# EAGLE design amplifier (EAGLE 7.6.0)
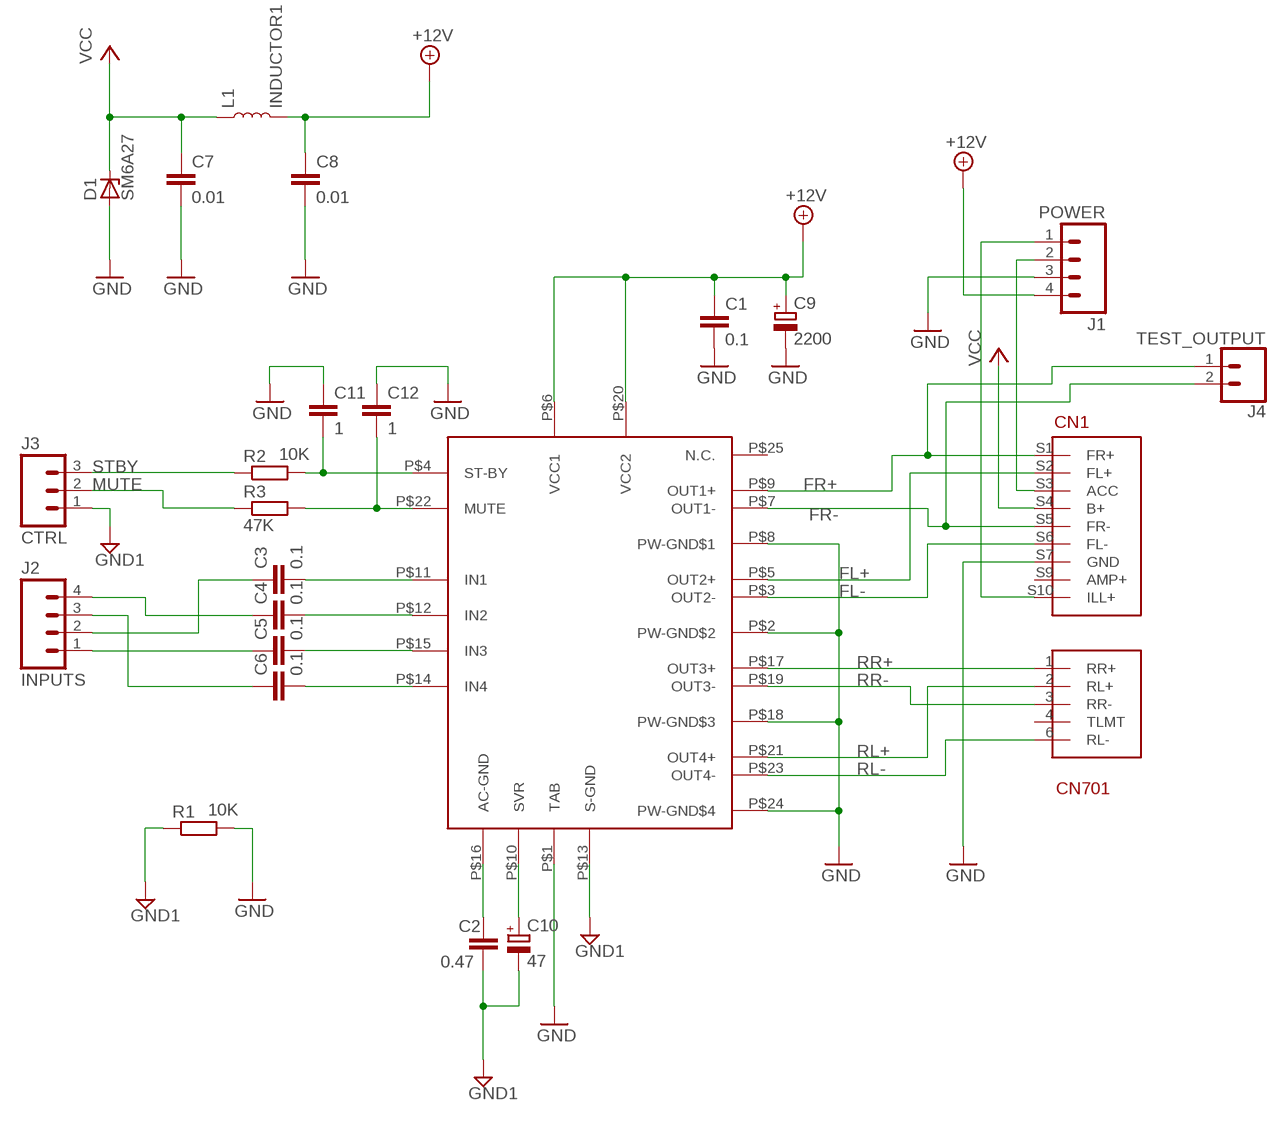
[diagram p0: schematic, sheet 1]

## Parts
C1  0.1  C-EUC1206  [C1206]
C2  0.47  C-EUC1206  [C1206]
C3  0.1  C-EUC1206  [C1206]
C4  0.1  C-EUC1206  [C1206]
C5  0.1  C-EUC1206  [C1206]
C6  0.1  C-EUC1206  [C1206]
C7  0.01  C-EUC1206  [C1206]
C8  0.01  C-EUC1206  [C1206]
C9  2200  CPOL-EUE5-10.5  [E5-10,5]
C10  47  CPOL-EUE5-4  [E5-4]
C11  1  C-EUC1206  [C1206]
C12  1  C-EUC1206  [C1206]
CN1  CN701  [CN701]
D1  SM6A27  [DO-218AB]
J1  POWER  M04LOCK_LONGPADS  [1X04_LOCK_LONGPADS]
J2  INPUTS  M04LOCK_LONGPADS  [1X04_LOCK_LONGPADS]
J3  CTRL  M03LOCK_LONGPADS  [1X03_LOCK_LONGPADS@1]
J4  TEST_OUTPUT  CONN_02LOCK_LONGPADS  [1X02_LOCK_LONGPADS]
L1  INDUCTOR1  [INDUCTOR1]
R1  10K  R-EU_M1206  [M1206]
R2  10K  R-EU_M1206  [M1206]
R3  47K  R-EU_M1206  [M1206]
U$1  TDA7386  [TDA7386]

## Nets
+12V: C1.1 C8.1 C9.+ J1.4 L1.2 U$1.P$6(VCC1) U$1.P$20(VCC2)
AC-GND-IN: C2.1 U$1.P$16(AC-GND)
ACC: CN1.S3(ACC) J1.2
FL+: CN1.S2(FL+) U$1.P$5(OUT2+)
FL-: CN1.S6(FL-) U$1.P$3(OUT2-)
FR+: CN1.S1(FR+) J4.1 U$1.P$9(OUT1+)
FR-: CN1.S5(FR-) J4.2 U$1.P$7(OUT1-)
GND: C1.2 C7.2 C8.2 C9.- C11.1 C12.1 CN1.S7(GND) D1.A J1.3 R1.2 U$1.P$1(TAB) U$1.P$2(PW-GND$2) U$1.P$8(PW-GND$1) U$1.P$18(PW-GND$3) U$1.P$24(PW-GND$4)
GND1: C2.2 C10.- J3.1 R1.1 U$1.P$13(S-GND)
ILL+: CN1.S10(ILL+) J1.1
IN1: C3.1 J2.2
IN2: C4.1 J2.4
IN3: C5.1 J2.1
IN4: C6.1 J2.3
MUTE: J3.2 R3.1
MUTE-IN: C12.2 R3.2 U$1.P$22(MUTE)
P_IN1: C3.2 U$1.P$11(IN1)
P_IN2: C4.2 U$1.P$12(IN2)
P_IN3: C5.2 U$1.P$15(IN3)
P_IN4: C6.2 U$1.P$14(IN4)
RL+: CN1.2(RL+) U$1.P$21(OUT4+)
RL-: CN1.6(RL-) U$1.P$23(OUT4-)
RR+: CN1.1(RR+) U$1.P$17(OUT3+)
RR-: CN1.3(RR-) U$1.P$19(OUT3-)
STBY: J3.3 R2.1
STBY-IN: C11.2 R2.2 U$1.P$4(ST-BY)
SVR-IN: C10.+ U$1.P$10(SVR)
VCC: C7.1 CN1.S4(B+) D1.C L1.1
Unconnected: CN1.4(TLMT) CN1.S9(AMP+) U$1.P$25(N.C.)

## Library data of the parts
C1-C8 C11 C12 = rcl:C-EU: CAPACITOR, European symbol
C9 C10 = rcl:CPOL-EU: POLARIZED CAPACITOR, European symbol
CN1 = Connectors:CN701: Connector to OEM head unit in Toyota Corolla E12
D1 = diodes:SM6A27: Surface Mount PAR® Transient Voltage Suppressors http://www.vishay.com/docs/88383/sm6a27.pdf
J1 J2 = SparkFun-Connectors:M04: Header 4 Standard 4-pin 0.1" header. Use with straight break away headers (SKU : PRT-00116), right angle break away headers (PRT-00553), swiss pins (PRT-00743), machine pins (PRT-00117), and female headers (PRT-00115). Molex polarized connector foot print use with SKU : PRT-08231 with associated crimp pins and housings. 1MM SMD Version SKU: PRT-10208; PROD_ID: CONN-09696
J3 = SparkFun-Connectors:M03: Header 3 Standard 3-pin 0.1" header. Use with straight break away headers (SKU : PRT-00116), right angle break away headers (PRT-00553), swiss pins (PRT-00743), machine pins (PRT-00117), and female headers (PRT-00115). Molex polarized connector foot print use with SKU : PRT-08232 with associated crimp pins and housings.
J4 = SparkFun-Connectors:CONN_02: Multi connection point. Often used as Generic Header-pin footprint for 0.1 inch spaced/style header connections On any of the 0.1 inch spaced packages, you can populate with these: Break Away Headers - Straight <https://www.sparkfun.com/products/116> (PRT-00116) Break Away Male Headers - Right Angle <https://www.sparkfun.com/products/553> (PRT-00553) Female Headers <https://www.sparkfun.com/products/115> (PRT-00115) Break Away Headers - Machine Pin <https://www.sparkfun.com/products/117> (PRT-00117) Break Away Female Headers - Swiss Machine Pin <https://www.sparkfun.com/products/743> (PRT-00743) For SCREWTERMINALS and SPRING TERMINALS visit here: Screw Terimnals on SparkFun.com <https://www.sparkfun.com/search/results?term=Screw+Terminals> (5mm/3.5mm/2.54mm spacing) This device is also useful as a general connection point to wire up your design to another part of your project. Our various solder wires solder well into these plated through hole pads. Hook-Up Wire - Assortment (Stranded, 22 AWG) <https://www.sparkfun.com/products/11375> (PRT-11375) Hook-Up Wire - Assortment (Solid Core, 22 AWG) <https://www.sparkfun.com/products/11367> (PRT-11367) View the entire wire category on our website here <https://www.sparkfun.com/categories/141> Special notes: Molex polarized connector foot print use with: PRT-08233 with associated crimp pins and housings. 2.54_SCREWTERM for use with PRT-10571. 3.5mm Screw Terminal footprints for PRT-08084 5mm Screw Terminal footprints for use with PRT-08432
L1 = induction:INDUCTOR1: This is inductor found in Panasonic Car Stereo in Toyota Corolla E12
R1-R3 = rcl:R-EU_: RESISTOR, European symbol
U$1 = tda7386:TDA7386

## Board
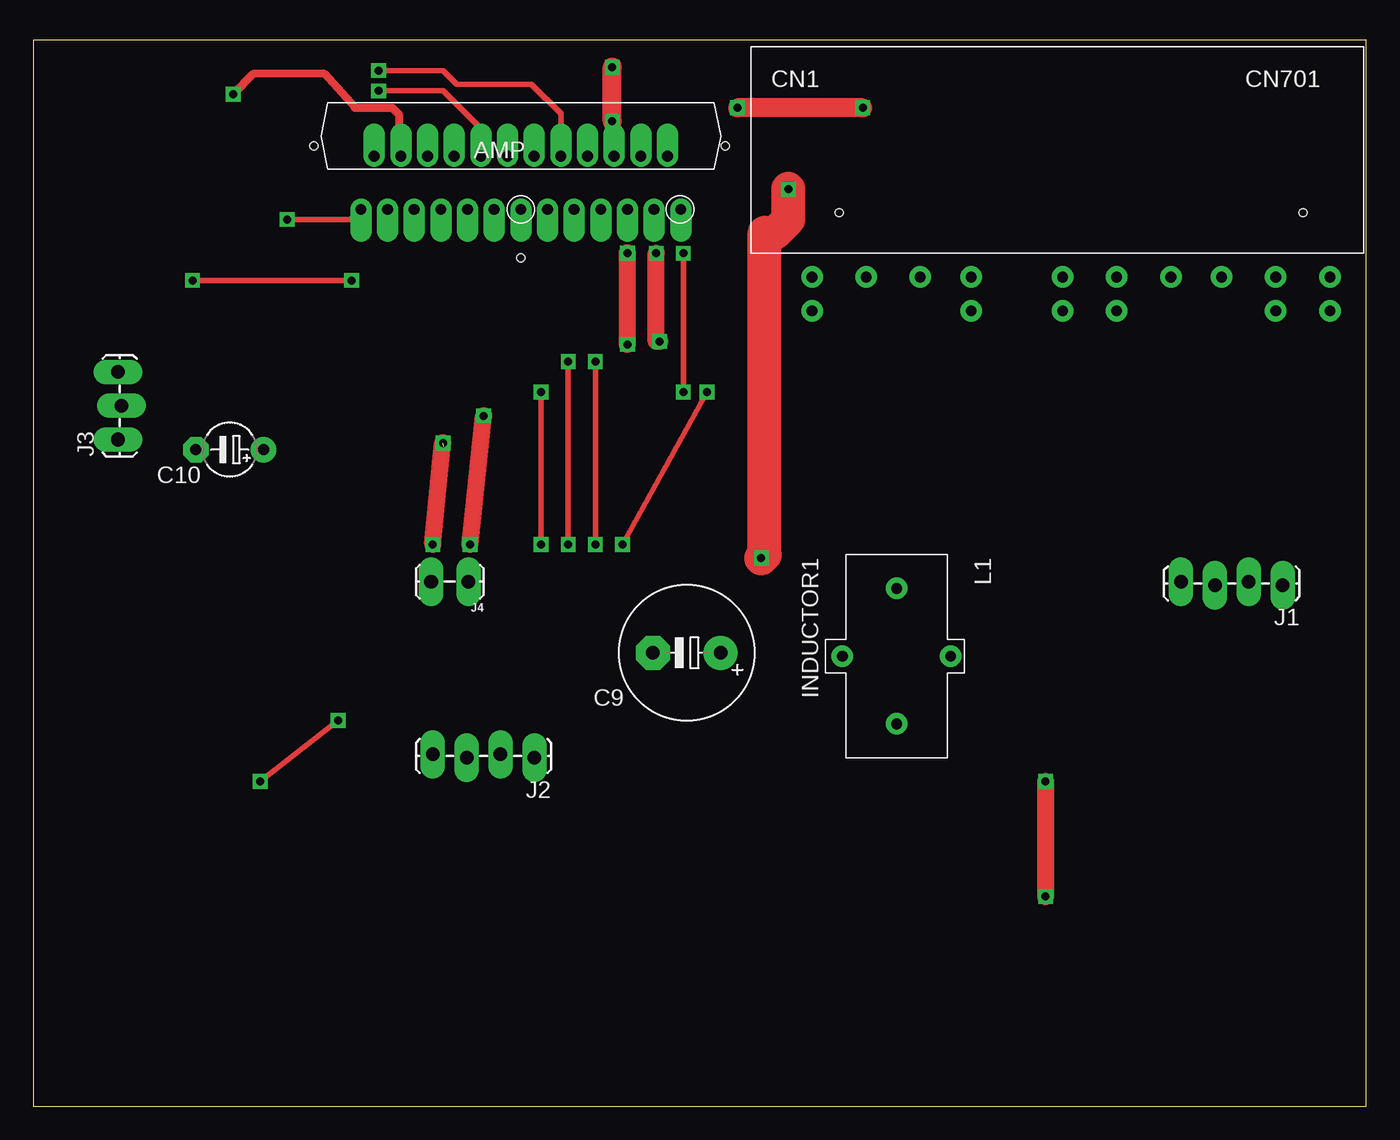
[diagram p1: board, top side]
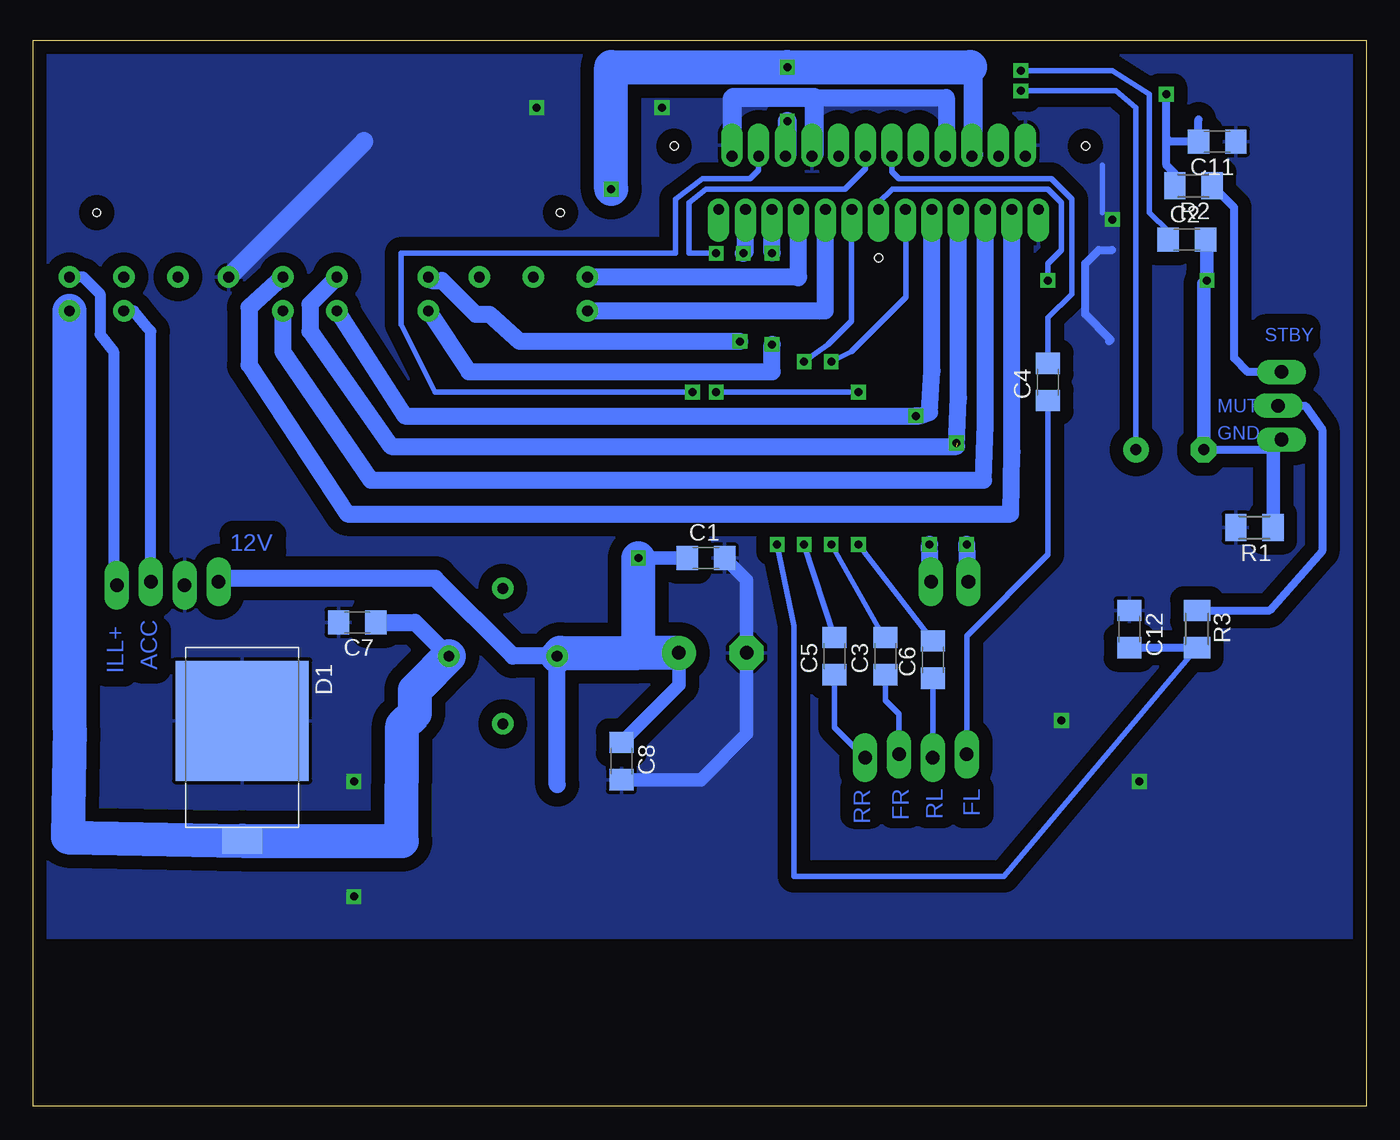
[diagram p2: board, bottom side, seen from below]

Size 100 x 80 mm. Coordinates in mm from the lower left corner, seen from the top.
Outline: 0,0 100,0 100,80 0,80 0,0
Copper layers (1*16): Top 0.035mm / dielectric 1.5mm / Bottom 0.035mm
Design rules "SparkFun2": minimum track width 8mil, minimum drill 20mil, track to track 8mil, track to pad 8mil, pad to pad 8mil, via to via 8mil, smd to smd 8mil, copper to edge 10mil, drill to drill 8mil, minimum pad ring 16mil, minimum via ring 10mil, stop-mask expansion 4mil, vias tented up to drill 25mil, thermal gap 10mil
tRestrict: 6 lines
bRestrict: 5 lines

### Footprints (pad centres in the part's own frame; a part is rotated, then mirrored left to right if it is on the bottom)
C1206 = smd 1.6 x 1.8: 1 -1.4,0; 2 1.4,0
E5-10,5 = drill 1.016 pad 2.54: + -2.54,0 | drill 1.016 pad 2.54 octagon: - 2.54,0
E5-4 = drill 0.813 pad 1.905: + -2.54,0 | drill 0.813 pad 1.905 octagon: - 2.54,0
CN701 = drill 0.8: 1 0,-2.54; 2 11.938,-2.54; 3 0,0; 4 4.064,0; 5 8.128,0; 6 11.938,0; S1 18.796,-2.54; S2 22.86,-2.54; S3 34.798,-2.54; S4 38.862,-2.54; S5 18.796,0; S6 22.86,0; S7 26.924,0; S8 30.734,0; S9 34.798,0; S10 38.862,0 | hole 0.6: 2.032,4.826; 36.83,4.826; -6.502,9.83; -37.363,9.83; -21.844,1.448
DO-218AB = smd 9 x 10: A -1.25,0 | smd 2 x 3: C 7.75,0
1X04_LOCK_LONGPADS = drill 1.016 long: 1 0,0; 2 2.54,-0.254; 3 5.08,0; 4 7.62,-0.254
1X03_LOCK_LONGPADS@1 = drill 1.016 long: 1 0,0; 2 2.54,-0.254; 3 5.08,0
1X02_LOCK_LONGPADS = drill 1.016 long: 1 -0.127,0; 2 2.667,0
INDUCTOR1 = drill 0.8: 1 5.08,4.064; 2 5.08,-4.064; P$1 0,0; P$2 10.16,0
M1206 = smd 1.6 x 2: 1 -1.4,0; 2 1.4,0
TDA7386 = drill 0.813 offset: P$1 -12,0; P$2 -11,4; P$3 -10,0; P$4 -9,4; P$5 -8,0; P$6 -7,4; P$7 -6,0; P$8 -5,4; P$9 -4,0; P$10 -3,4; P$11 -2,0; P$12 -1,4; P$13 0,0; P$14 1,4; P$15 2,0; P$16 3,4; P$17 4,0; P$18 5,4; P$19 6,0; P$20 7,4; P$21 8,0; P$22 9,4; P$23 10,0; P$24 11,4; P$25 12,0

### Placement (x,y rotation side)
C1  49.53,41.15 0 bottom
C2  13.46,65.02 0 bottom
C3  36.07,33.78 90 bottom
C4  23.88,54.36 90 bottom
C5  39.88,33.78 90 bottom
C6  32.51,33.53 90 bottom
C7  75.69,36.32 180 bottom
C8  55.88,25.91 270 bottom
C9  49.02,34.04 180 top
C10  14.73,49.28 180 top
C11  11.18,72.39 180 bottom
C12  17.78,35.81 270 bottom
CN1  58.42,62.23 0 top
D1  84.33,27.69 270 bottom
J1  93.73,39.12 180 top
J2  37.59,26.16 180 top
J3  6.35,50.04 90 top
J4  32.51,39.37 180 top
L1  64.77,38.86 270 top
R1  8.38,43.43 180 bottom
R2  12.95,69.09 180 bottom
R3  12.7,35.81 270 bottom
U$1  36.58,67.31 0 top

### Tracks (layer width: path | path; a pad name or v marks a point on that pad's centre or on a via)
+12V  (via drill 0.6)
  Top 1.422: v43.43,73.91 v43.43,77.98
  Top 2.54: v54.61,41.15 54.86,41.4 54.86,65.53 55.63,65.53 56.64,66.55 v56.64,68.83
  Bottom 1.016: C8.1 51.56,31.63 C9.+ | v54.61,41.15 C1.1
  Bottom 1.27: 60.71,24.13 L1.2 64.01,33.78 69.85,39.62 85.85,39.62 J1.4
  Bottom 1.422: U$1.P$6 29.46,71.42 29.46,78.49 29.72,78.23 29.72,77.98 | U$1.P$20 43.43,71.45 v43.43,73.91
  Bottom 2.54: L1.2 60.45,34.04 54.61,34.04 | 54.61,34.04 54.86,34.29 | v56.64,68.83 56.64,77.98 v43.43,77.98 29.72,77.98 | 54.61,34.04 v54.61,41.15 | C9.+ 54.61,34.04
AC-GND-IN  (via drill 0.6)
  Top 0.406: U$1.P$16 39.58,74.47 37.34,76.71 31.75,76.71 30.73,77.72 v25.91,77.72
  Bottom 0.406: v25.91,77.72 19.05,77.72 16.26,75.95 16.26,67.06 14.86,65.66 C2.1
ACC
  Bottom 0.813: CN1.S3 92.46,59.69 91.44,58.42 91.19,58.17 J1.2
FL+
  Bottom 1.27: CN1.S2 81.28,56.64 74.68,46.99 28.7,46.99 28.58,51.18 U$1.P$5
FL-
  Bottom 1.27: CN1.S6 83.82,59.94 83.82,55.63 76.45,44.45 26.67,44.45 26.58,49.12 U$1.P$3
FR+  (via drill 0.6)
  Top 1.27: v32.77,42.16 v33.78,51.82
  Bottom 1.27: CN1.S1 72.14,51.82 v33.78,51.82 33.53,51.82 32.77,52.07 32.58,55.18 U$1.P$9 | J4.1 v32.77,42.16
FR-  (via drill 0.6)  (1 unrouted)
  Top 1.27: v29.97,42.16 30.72,49.78
  Bottom 1.27: CN1.S5 79.25,60.2 79.25,58.17 73.15,49.53 30.73,49.53 30.58,53.18 U$1.P$7 | J4.2 v29.97,42.16
GND  (via drill 0.6)
  Top 0.406: v19.05,66.55 23.81,66.55 U$1.P$1 | v17.02,24.38 v22.86,28.96
  Top 1.27: v75.95,24.38 v75.95,15.75
  Top 1.422: v62.23,74.93 v52.83,74.93
  Bottom 0.406: 19.81,70.61 19.81,67.06
  Bottom 0.61: 19.05,64.26 20.07,64.26 21.08,63.25 21.08,59.44 19.18,57.53 19.3,57.4
  Bottom 1.016: C1.2 46.48,39.5 C9.- 46.48,27.94 49.91,24.51 C8.2
  Bottom 1.27: 41.4,75.69 31.5,75.69 31.5,71.39 U$1.P$8
  Bottom 1.422: U$1.P$18 41.4,71.48 41.4,75.69 47.5,75.69 47.58,75.61 U$1.P$24 | CN1.S7 75.18,72.39
  pour Bottom (isolate 1.016): 0,80.01 100.08,80.01 99.82,12.7 -0.25,12.7
GND1  (via drill 0.6)
  Top 0.406: 36.58,65.79 U$1.P$13 | v23.88,61.98 v11.94,61.98
  Bottom 0.406: 36.58,66.29 U$1.P$13 36.58,67.82 35.56,68.83 23.88,68.83 22.86,67.82 22.86,64.26 23.88,63.25 v23.88,61.98
  Bottom 0.61: C10.- 7.11,49.28 J3.1
  Bottom 1.016: 5.97,49.65 J3.1 6.98,49.41 R1.1 | C10.- 12.19,61.72 v11.94,61.98 11.94,64.9 C2.2
ILL+
  Bottom 0.813: CN1.S10 96.27,62.23 95,60.96 95,57.91 93.98,56.64 93.98,39.37 J1.1
IN1
  Bottom 0.406: J2.2 35.05,29.46 36.07,30.48 C3.1
IN2
  Bottom 0.406: J2.4 29.97,35.31 23.88,41.4 C4.1
IN3
  Bottom 0.406: J2.1 39.88,28.45 C5.1
IN4
  Bottom 0.406: J2.3 C6.1
MUTE
  Bottom 0.61: J3.2 4.57,52.58 3.3,50.8 3.3,41.66 7.24,37.21 R3.1
MUTE-IN  (via drill 0.6)
  Top 0.406: v50.55,53.59 v44.2,42.16
  Bottom 0.406: U$1.P$22 45.58,70.25 46.23,69.6 49.78,69.6 51.82,68.07 51.82,64.01 72.39,64.01 72.39,58.67 69.85,53.59 v50.55,53.59 | v44.2,42.16 42.93,36.07 42.93,17.27 27.18,17.27 R3.2
  Bottom 0.61: U$1.P$22 45.72,71.17 | R3.2 C12.2
N$1  (via drill 0.6)
  other vias: 30.73,49.78
P_IN1  (via drill 0.6)
  Top 0.406: v40.13,42.16 v40.13,55.88
  Bottom 0.406: C3.2 36.32,35.44 v40.13,42.16 | v40.13,55.88 38.61,56.64 34.54,60.71 34.54,67.28 U$1.P$11
P_IN2
  Bottom 0.406: U$1.P$12 35.58,70.12 35.05,69.6 23.62,69.6 22.1,68.07 22.1,60.96 23.88,59.18 C4.2
P_IN3  (via drill 0.6)
  Top 0.406: v42.16,42.16 v42.16,55.88
  Bottom 0.406: C5.2 v42.16,42.16 | v42.16,55.88 40.39,57.15 38.61,58.93 38.61,67.28 U$1.P$15
P_IN4  (via drill 0.6)
  Top 0.406: v38.1,42.16 v38.1,53.59 | v48.77,53.59 v48.77,64.01
  Bottom 0.406: C6.2 v38.1,42.16 | v38.1,53.59 v48.77,53.59 | U$1.P$14 37.58,70.37 39.12,68.83 49.53,68.83 50.8,67.82 50.8,64.01 v48.77,64.01
RL+  (via drill 0.6)
  Top 1.27: v44.58,57.17 v44.58,64.03
  Bottom 1.27: CN1.2 67.31,55.12 44.6,55.12 arc-90 44.58,55.14 v44.58,57.17 | v44.58,64.03 U$1.P$21
RL-  (via drill 0.6)
  Top 1.27: v46.99,57.4 46.74,57.4 v46.74,64.01
  Bottom 1.27: CN1.6 70.1,61.98 69.34,61.98 66.8,59.44 65.79,59.44 63.5,57.4 v46.99,57.4 | v46.74,64.01 46.58,64.17 U$1.P$23
RR+
  Bottom 1.27: U$1.P$17 40.58,59.7 41.07,59.69 CN1.1
RR-
  Bottom 1.27: 58.37,62.18 CN1.3 42.67,62.23 42.62,62.18 42.58,62.22 U$1.P$19
STBY
  Bottom 0.61: J3.3 8.89,55.12 9.91,56.13 9.91,67.44 R2.1
STBY-IN  (via drill 0.6)
  Top 0.61: U$1.P$4 27.43,71.45 27.43,74.42 26.92,74.93 24.13,74.93 21.84,77.47 16.51,77.47 v14.99,75.95
  Bottom 0.61: R2.2 14.35,69.98 14.99,70.61 14.99,72.64 | 14.99,72.64 v14.99,75.95 | 12.58,74.04 C11.2 14.73,72.39 14.99,72.64
SVR-IN  (via drill 0.6)
  Top 0.406: U$1.P$10 33.58,73.36 30.73,76.2 v25.91,76.2
  Bottom 0.406: v25.91,76.2 18.8,76.2 17.27,74.93 C10.+
VCC
  Bottom 0.61: 71.88,32 71.37,32 70.99,31.62
  Bottom 1.27: C7.1 71.37,36.32 L1.1
  Bottom 2.54: CN1.S4 97.28,28.45 97.41,20.19 D1.C 72.37,19.91 72.31,28.55 71.37,29.49 71.37,31.24 70.99,31.62 L1.1

### Text on the board
Bottom: STBY | MUT | GND | 12V | ACC | ILL+ | FL | RL | FR | RR